# EAGLE design LuminchOne (EAGLE 6.5.0)
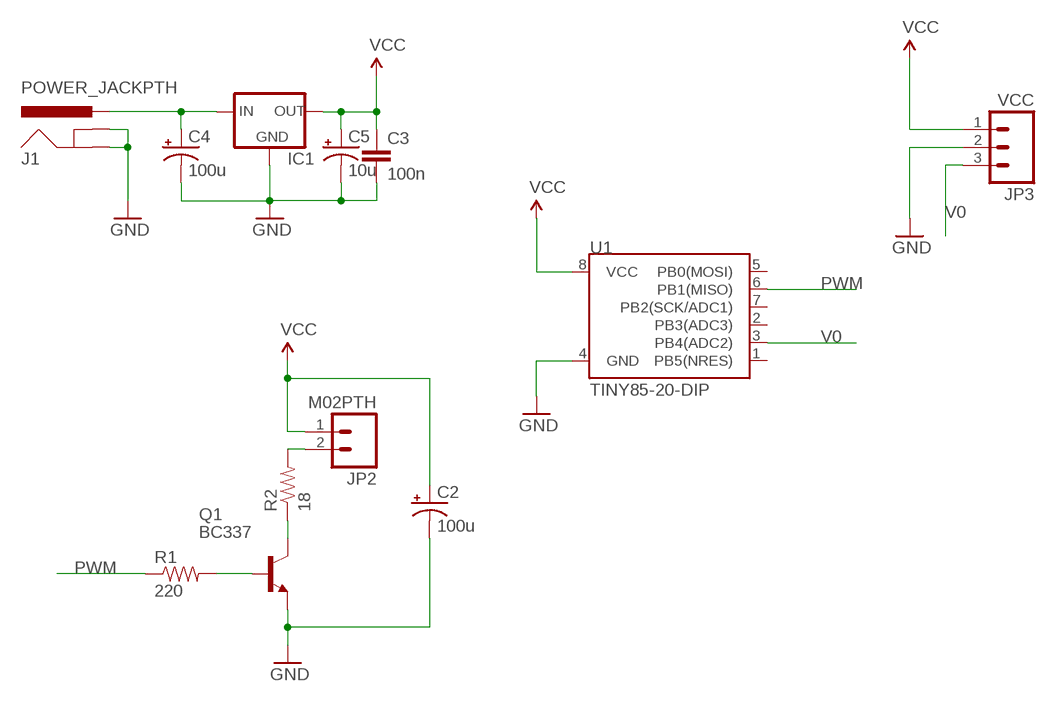
[diagram p0: schematic, sheet 1]

## Parts
C2  100u  CAP_POLPTH1  [CPOL-RADIAL-100UF-25V]
C3  100n  CAPPTH  [CAP-PTH-SMALL]
C4  100u  CAP_POLPTH1  [CPOL-RADIAL-100UF-25V]
C5  10u  CAP_POLPTH2  [CPOL-RADIAL-10UF-25V]
IC1  V_REG_78XX-TO-220  [TO-220-ALT]
J1  POWER_JACKPTH  [POWER_JACK_PTH]
JP2  M02PTH  [1X02]
JP3  VCC  M03PTH  [1X03]
Q1  BC337  [TO92]
R1  220  RESISTORPTH-1/4W  [AXIAL-0.4]
R2  18  RESISTORPTH-1W  [AXIAL-0.6]
U1  TINY85-20-DIP  ATTINY45TINY85-20-DIP  [DIP08]

## Nets
GND: C2.2(-) C3.2 C4.2(-) C5.2(-) IC1.GND J1.GND J1.GNDBREAK JP3.2 Q1.1(E) U1.4(GND)
N$1: Q1.2(B) R1.P$2
N$2: JP2.2 R2.P$2
N$3: C4.1(+) IC1.IN J1.PWR
N$4: Q1.3(C) R2.P$1
PWM: R1.P$1 U1.6(PB1(MISO))
V0: JP3.3 U1.3(PB4(ADC2))
VCC: C2.1(+) C3.1 C5.1(+) IC1.OUT JP2.1 JP3.1 U1.8(VCC)
Unconnected: U1.1(PB5(NRES)) U1.2(PB3(ADC3)) U1.5(PB0(MOSI)) U1.7(PB2(SCK/ADC1))

## Library data of the parts
C2 C4 C5 = SparkFun-Capacitors:CAP_POL: Capacitor Polarized These are standard SMD and PTH capacitors. Normally 10uF, 47uF, and 100uF in electrolytic and tantalum varieties. Always verify the external diameter of the through hole cap, it varies with capacity, voltage, and manufacturer. The EIA devices should be standard.
C3 = SparkFun-Capacitors:CAP: Capacitor Standard 0603 ceramic capacitor, and 0.1" leaded capacitor.
IC1 = SparkFun-PowerIC:V_REG_78XX: Voltage Regulator Standard 7805 5V regulator. IGO (Input Ground Output). Spark Fun Electronics SKU : COM-00107
J1 = SparkFun-Connectors:POWER_JACK: Power Jack This is the standard 5.5mm barrel jack for power. The PTH is the most common, proven, reliable, footprint. The Slot footprint only works if the mill layer is transmitted to the PCB fab house so be warned. Spark Fun Electronics SKU : PRT-00119 SMT: CONN-08106 Mating wall wart : TOL-00298 (and others)
JP2 = SparkFun-Connectors:M02: Standard 2-pin 0.1" header. Use with - straight break away headers ( PRT-00116) - right angle break away headers (PRT-00553) - swiss pins (PRT-00743) - machine pins (PRT-00117) - female headers (PRT-00115) Molex polarized connector foot print use with: PRT-08233 with associated crimp pins and housings. 2.54_SCREWTERM for use with PRT-10571. 3.5mm Screw Terminal footprints for PRT-08084 5mm Screw Terminal footprints for use with PRT-08433
JP3 = SparkFun-Connectors:M03: Header 3 Standard 3-pin 0.1" header. Use with straight break away headers (SKU : PRT-00116), right angle break away headers (PRT-00553), swiss pins (PRT-00743), machine pins (PRT-00117), and female headers (PRT-00115). Molex polarized connector foot print use with SKU : PRT-08232 with associated crimp pins and housings.
Q1 = transistor-npn-biggerHoles:BC337*: NPN Transistor
R1 R2 = SparkFun-Resistors:RESISTOR: Resistor Basic schematic elements and footprints for 0603, 1206, and PTH resistors.
U1 = SparkFun-DigitalIC:ATTINY45: Atmel 8-pin 2/4/8kB flash uC; PROD_ID: IC-09445

## Net classes
0 default: clearance 0.205 mm

## Board
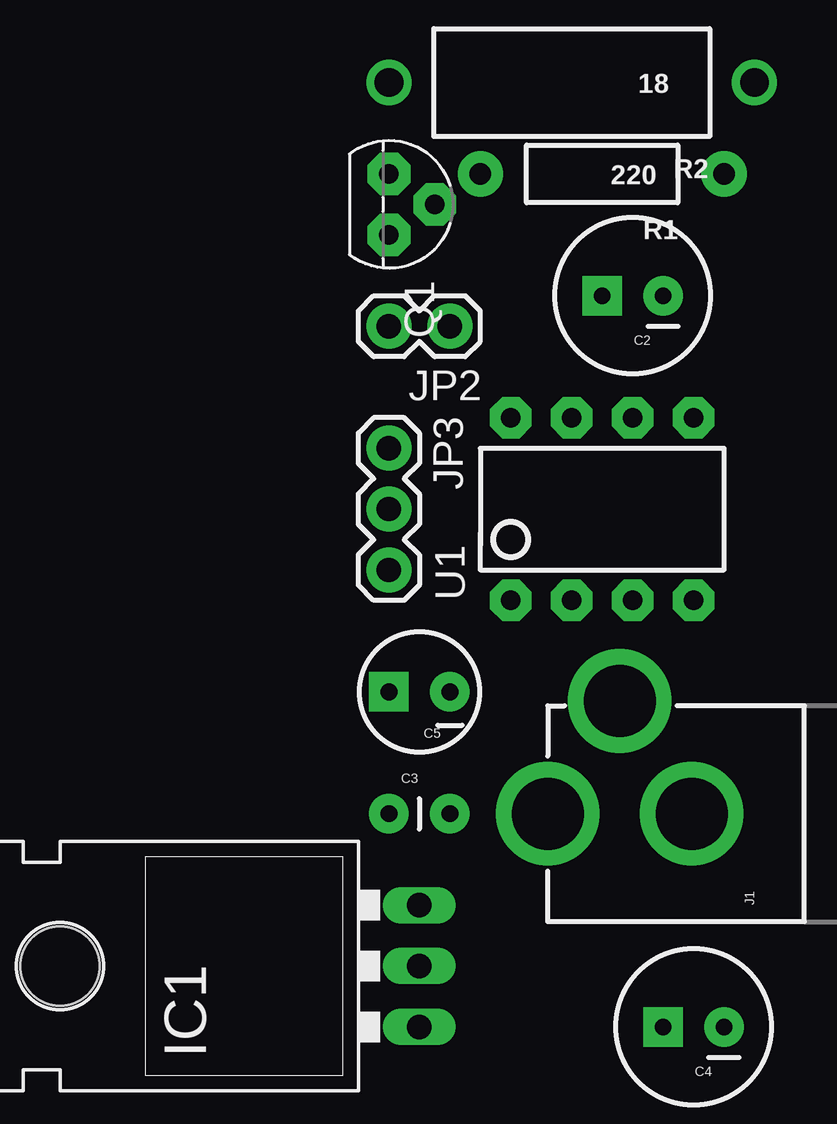
[diagram p1: board, top side]
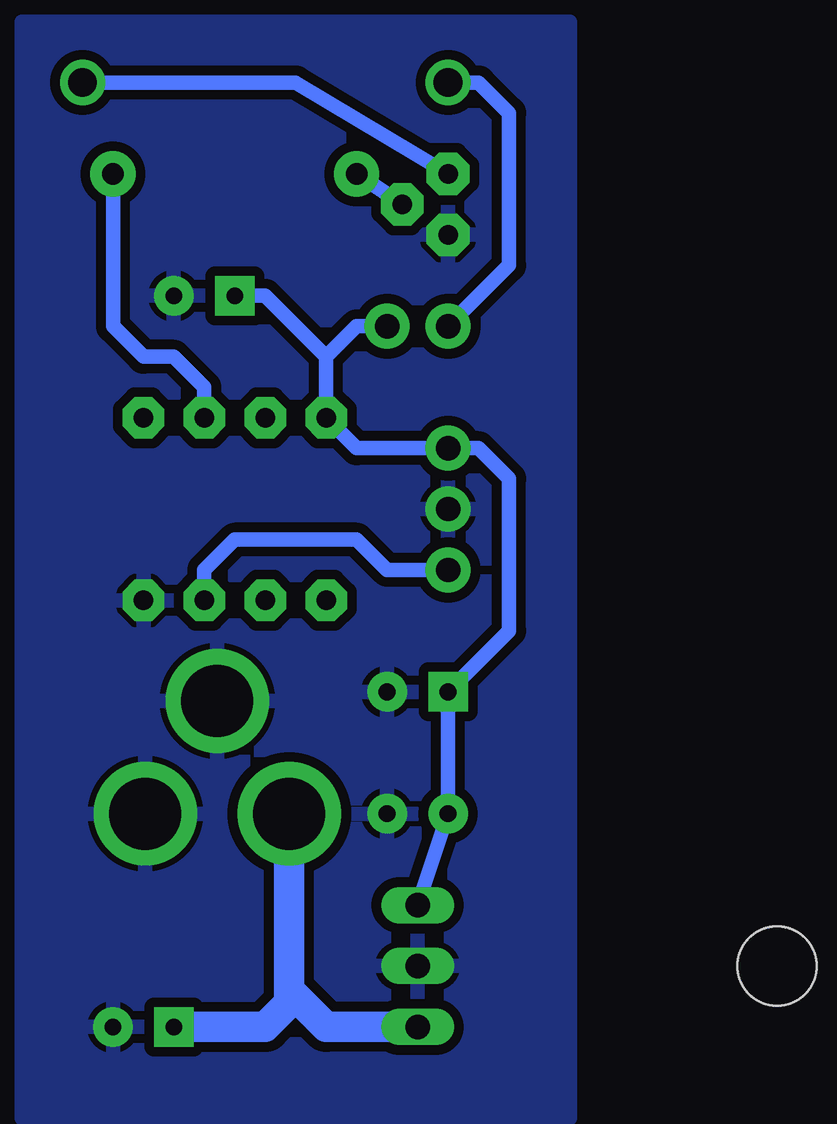
[diagram p2: board, bottom side, seen from below]

No outline drawn. Coordinates in mm, seen from the top.
Copper layers (1*16): Top 0.035mm / dielectric 1.5mm / Bottom 0.035mm
Design rules "default *": minimum track width 20mil, minimum drill 24mil, track to track 16mil, track to pad 16mil, pad to pad 12mil, via to via 12mil, smd to smd 12mil, copper to edge 40mil, drill to drill 8mil, minimum pad ring 10mil, minimum via ring 8mil, stop-mask expansion 4mil, vias tented up to drill 0mil, thermal gap 10mil

### Footprints (pad centres in the part's own frame; a part is rotated, then mirrored left to right if it is on the bottom)
CPOL-RADIAL-100UF-25V = drill 0.7 pad 1.651 square: 1 1.27,0 | drill 0.7 pad 1.651: 2 -1.27,0
CAP-PTH-SMALL = drill 0.7 pad 1.651: 1 0,0; 2 2.54,0
CPOL-RADIAL-10UF-25V = drill 0.7 pad 1.651 square: 1 1.27,0 | drill 0.7 pad 1.651: 2 -1.27,0
TO-220-ALT = drill 1.016 long: GND 0,-3.81; IN -2.54,-3.81; OUT 2.54,-3.81 | hole 3.302: 0,11.176
POWER_JACK_PTH = drill 2.997 pad 4.318: GND 0,7.7; GNDBREAK 4.7,10.7; PWR 0,13.7
1X02 = drill 1.016 pad 1.88: 1 0,0; 2 2.54,0
1X03 = drill 1.016 pad 1.88: 1 0,0; 2 2.54,0; 3 5.08,0
TO92 = drill 0.813 pad 1.778 octagon: 1 1.27,0; 2 0,1.905; 3 -1.27,0
AXIAL-0.4 = drill 0.9 pad 1.88: P$1 -5.08,0; P$2 5.08,0
AXIAL-0.6 = drill 1.2 pad 1.88: P$1 -7.62,0; P$2 7.62,0
DIP08 = drill 0.813 pad 1.727 octagon: 1 -3.81,-3.81; 2 -1.27,-3.81; 3 1.27,-3.81; 4 3.81,-3.81; 5 3.81,3.81; 6 1.27,3.81; 7 -1.27,3.81; 8 -3.81,3.81

### Placement (x,y rotation side)
C2  13.97,34.29 180 top
C3  3.81,12.7 0 top
C4  16.51,3.81 180 top
C5  5.08,17.78 180 top
IC1  1.27,6.35 90 top
J1  24.13,12.7 90 top
JP2  6.35,33.02 180 top
JP3  3.81,27.94 270 top
Q1  3.81,38.1 270 top
R1  12.7,39.37 180 top
R2  11.43,43.18 180 top
U1  12.7,25.4 0 top

### Tracks (layer width: path | path; a pad name or v marks a point on that pad's centre or on a via)
GND
  pour Bottom: -1.27,0 -1.27,45.72 21.59,45.72 21.59,0
N$1
  Bottom 0.61: Q1.2 R1.P$2
N$2
  Bottom 0.61: JP2.2 1.27,35.56 1.27,41.91 2.54,43.18 R2.P$2
N$3
  Bottom 1.27: IC1.IN 8.89,3.81 10.43,5.35 | 10.43,5.35 J1.PWR | C4.1 11.43,3.81 10.43,4.81 10.43,5.35
N$4
  Bottom 0.61: Q1.3 10.16,43.18 R2.P$1
PWM
  Bottom 0.61: U1.6 13.97,30.48 15.24,31.75 16.51,31.75 17.78,33.02 R1.P$1
V0
  Bottom 0.61: JP3.3 6.35,22.86 7.62,24.13 12.7,24.13 13.97,22.86 U1.3
VCC
  Bottom 0.61: IC1.OUT C3.1 C5.1 1.27,20.32 1.27,26.67 2.54,27.94 JP3.1 7.62,27.94 U1.8 8.89,31.75 | 8.89,31.75 7.62,33.02 JP2.1 | C2.1 11.43,34.29 8.89,31.75